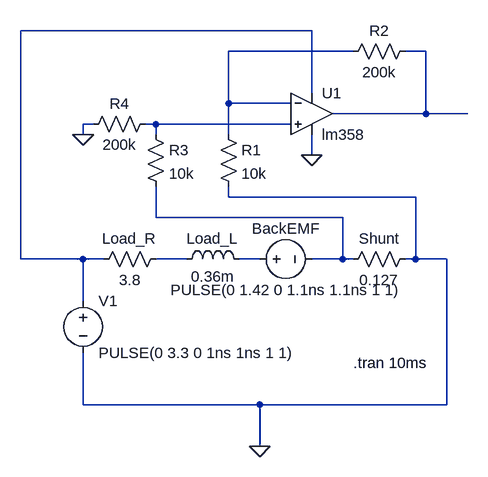
[diagram p0: schematic import.asc]
import.asc, the LTspice schematic file:
Version 4.1
SHEET 1 880 680
WIRE 240 -288 -208 -288
WIRE 304 -256 112 -256
WIRE 416 -256 384 -256
WIRE 240 -192 240 -288
WIRE 112 -176 112 -256
WIRE 208 -176 112 -176
WIRE 416 -160 416 -256
WIRE 416 -160 272 -160
WIRE 480 -160 416 -160
WIRE -96 -144 -112 -144
WIRE 0 -144 -16 -144
WIRE 208 -144 0 -144
WIRE -112 -128 -112 -144
WIRE 0 -128 0 -144
WIRE 112 -128 112 -176
WIRE 240 -96 240 -128
WIRE 112 -32 112 -48
WIRE 400 -32 112 -32
WIRE 0 0 0 -48
WIRE 288 0 0 0
WIRE -208 64 -208 -288
WIRE -112 64 -208 64
WIRE -80 64 -112 64
WIRE 48 64 0 64
WIRE 160 64 128 64
WIRE 288 64 288 0
WIRE 288 64 240 64
WIRE 304 64 288 64
WIRE 400 64 400 -32
WIRE 400 64 384 64
WIRE 448 64 400 64
WIRE -112 128 -112 64
WIRE -112 288 -112 208
WIRE 160 288 -112 288
WIRE 448 288 448 64
WIRE 448 288 160 288
WIRE 160 352 160 288
FLAG 160 352 0
FLAG -112 -128 0
FLAG 240 -96 0
SYMBOL lm358 240 -224 R0
SYMATTR InstName U1
SYMBOL res 288 80 R270
WINDOW 0 32 56 VTop 2
WINDOW 3 0 56 VBottom 2
SYMATTR InstName Shunt
SYMATTR Value 0.127
SYMBOL voltage -112 112 R0
WINDOW 123 0 0 Left 0
WINDOW 39 0 0 Left 0
SYMATTR InstName V1
SYMATTR Value PULSE(0 3.3 0 1ns 1ns 1 1)
SYMBOL res -16 -144 R0
SYMATTR InstName R3
SYMATTR Value 10k
SYMBOL res -112 -128 R270
WINDOW 0 32 56 VTop 2
WINDOW 3 0 56 VBottom 2
SYMATTR InstName R4
SYMATTR Value 200k
SYMBOL res 96 -144 R0
SYMATTR InstName R1
SYMATTR Value 10k
SYMBOL res 400 -272 R90
WINDOW 0 0 56 VBottom 2
WINDOW 3 32 56 VTop 2
SYMATTR InstName R2
SYMATTR Value 200k
SYMBOL res -96 80 R270
WINDOW 0 32 56 VTop 2
WINDOW 3 0 56 VBottom 2
SYMATTR InstName Load_R
SYMATTR Value 3.8
SYMBOL ind 32 80 R270
WINDOW 0 32 56 VTop 2
WINDOW 3 5 56 VBottom 2
SYMATTR InstName Load_L
SYMATTR Value 0.36m
SYMATTR SpiceLine Rser=1m
SYMBOL voltage 144 64 R270
WINDOW 0 32 56 VTop 2
WINDOW 3 -32 56 VBottom 2
WINDOW 123 0 0 Left 0
WINDOW 39 0 0 Left 0
SYMATTR InstName BackEMF
SYMATTR Value PULSE(0 1.42 0 1.1ns 1.1ns 1 1)
TEXT 304 224 Left 2 !.tran 10ms

The netlist it stands for:
* import.asc
* U1: lm358 (symbol lm358 not available, pins judged from their places): In+=N004 In-=N002 V+=N001 V-=0 OUT=N003
R§Shunt N005 0 0.127
V1 N001 0 PULSE(0 3.3 0 1ns 1ns 1 1)
R3 N004 N005 10k
R4 0 N004 200k
R1 N002 0 10k
R2 N003 N002 200k
R§Load_R N001 N006 3.8
Load_L N006 N007 0.36m Rser=1m
V§BackEMF N007 N005 PULSE(0 1.42 0 1.1ns 1.1ns 1 1)
.tran 10ms
.backanno
.end